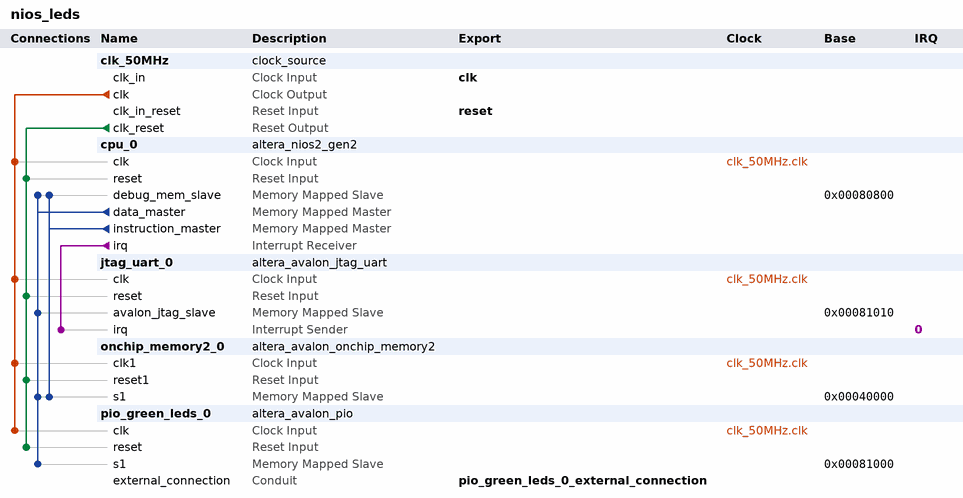
[diagram p0: system contents]
# Platform Designer (Qsys) system nios_leds, Cyclone IV E EP4CE115F29C7
# Parameters at their usual value, and those the tool derives, are not listed.
package require -exact qsys 20.1
create_system nios_leds
set_project_property DEVICE_FAMILY {Cyclone IV E}
set_project_property DEVICE EP4CE115F29C7

add_instance clk_50MHz clock_source 20.1
set_instance_parameter_value clk_50MHz clockFrequency 50000000

add_instance cpu_0 altera_nios2_gen2 20.1
set_instance_parameter_value cpu_0 dcache_size 2048
set_instance_parameter_value cpu_0 exceptionSlave onchip_memory2_0.s1
set_instance_parameter_value cpu_0 icache_size 4096
set_instance_parameter_value cpu_0 impl Tiny
set_instance_parameter_value cpu_0 resetSlave onchip_memory2_0.s1

add_instance jtag_uart_0 altera_avalon_jtag_uart 20.1
set_instance_parameter_value jtag_uart_0 simInteractiveOptions NO_INTERACTIVE_WINDOWS

add_instance onchip_memory2_0 altera_avalon_onchip_memory2 20.1
set_instance_parameter_value onchip_memory2_0 dataWidth 32
set_instance_parameter_value onchip_memory2_0 dualPort false
set_instance_parameter_value onchip_memory2_0 initMemContent true
set_instance_parameter_value onchip_memory2_0 initializationFileName onchip_mem.hex
set_instance_parameter_value onchip_memory2_0 memorySize 204800

add_instance pio_green_leds_0 altera_avalon_pio 20.1
set_instance_parameter_value pio_green_leds_0 direction Output
set_instance_parameter_value pio_green_leds_0 resetValue 170
set_instance_parameter_value pio_green_leds_0 width 9

# connections
add_connection clk_50MHz.clk cpu_0.clk clock
add_connection clk_50MHz.clk jtag_uart_0.clk clock
add_connection clk_50MHz.clk onchip_memory2_0.clk1 clock
add_connection clk_50MHz.clk pio_green_leds_0.clk clock
add_connection clk_50MHz.clk_reset cpu_0.reset reset
add_connection clk_50MHz.clk_reset jtag_uart_0.reset reset
add_connection clk_50MHz.clk_reset onchip_memory2_0.reset1 reset
add_connection clk_50MHz.clk_reset pio_green_leds_0.reset reset
add_connection cpu_0.data_master cpu_0.debug_mem_slave avalon
set_connection_parameter_value cpu_0.data_master/cpu_0.debug_mem_slave baseAddress 0x00080800
add_connection cpu_0.data_master jtag_uart_0.avalon_jtag_slave avalon
set_connection_parameter_value cpu_0.data_master/jtag_uart_0.avalon_jtag_slave baseAddress 0x00081010
add_connection cpu_0.data_master onchip_memory2_0.s1 avalon
set_connection_parameter_value cpu_0.data_master/onchip_memory2_0.s1 baseAddress 0x00040000
add_connection cpu_0.data_master pio_green_leds_0.s1 avalon
set_connection_parameter_value cpu_0.data_master/pio_green_leds_0.s1 baseAddress 0x00081000
add_connection cpu_0.instruction_master cpu_0.debug_mem_slave avalon
set_connection_parameter_value cpu_0.instruction_master/cpu_0.debug_mem_slave baseAddress 0x00080800
add_connection cpu_0.instruction_master onchip_memory2_0.s1 avalon
set_connection_parameter_value cpu_0.instruction_master/onchip_memory2_0.s1 baseAddress 0x00040000
add_connection cpu_0.irq jtag_uart_0.irq interrupt
set_connection_parameter_value cpu_0.irq/jtag_uart_0.irq irqNumber 0

# exported interfaces
add_interface clk clock sink
set_interface_property clk EXPORT_OF clk_50MHz.clk_in
add_interface pio_green_leds_0_external_connection conduit end
set_interface_property pio_green_leds_0_external_connection EXPORT_OF pio_green_leds_0.external_connection
add_interface reset reset sink
set_interface_property reset EXPORT_OF clk_50MHz.clk_in_reset

set_interconnect_requirement {$system} qsys_mm.clockCrossingAdapter HANDSHAKE
set_interconnect_requirement {$system} qsys_mm.enableEccProtection FALSE
set_interconnect_requirement {$system} qsys_mm.insertDefaultSlave FALSE
set_interconnect_requirement {$system} qsys_mm.maxAdditionalLatency 1

save_system nios_leds.qsys
